# Altium schematic sheet IgnitionCoil.SchDoc
size Tabloid
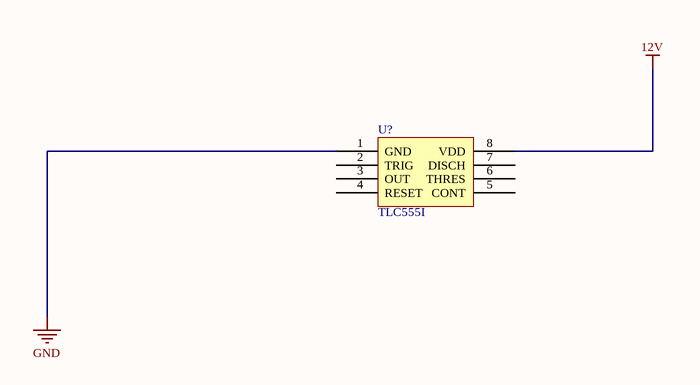
[diagram p0: IgnitionCoil.SchDoc]

## Parts
U?  TLC555I

## Nets
12V: U?.8(VDD)
GND: U?.1(GND)

Not connected (* = marked no-connect by the designer): U? 2(TRIG) 3(OUT) 4(RESET) 5(CONT) 6(THRES) 7(DISCH)

## Library data of the parts
U? = TLC555I: Manufacturer: Texas Instrument; Package: SOIC-8; Manufacturer P/N: TLC555I